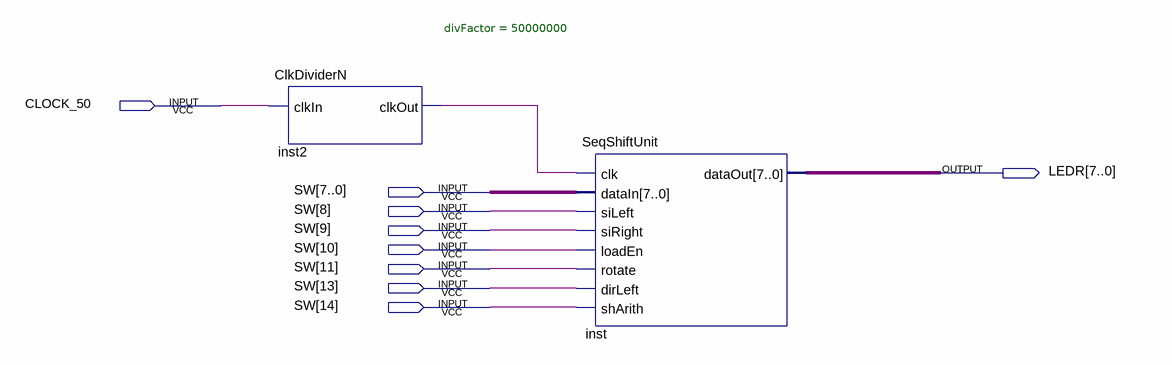
[diagram p0: schematic sheet]
// Quartus schematic SeqShiftUnit_Demo.bdf as structural Verilog: 2 symbols, 9 pins
module SeqShiftUnit_Demo (
  input  CLOCK_50,
  input  [14:0] SW,
  output [7:0] LEDR
);

  wire inst2_clkout;

  ClkDividerN #(.divFactor(50000000)) inst2 (.clkIn(CLOCK_50), .clkOut(inst2_clkout));
  SeqShiftUnit inst (
    .clk(inst2_clkout), .dataIn(SW[7:0]), .siLeft(SW[8]), .siRight(SW[9]), .loadEn(SW[10]), .rotate(SW[11]),
    .dirLeft(SW[13]), .shArith(SW[14]), .dataOut(LEDR));
endmodule
